# EAGLE design icp_lm2596 (EAGLE 6.3)
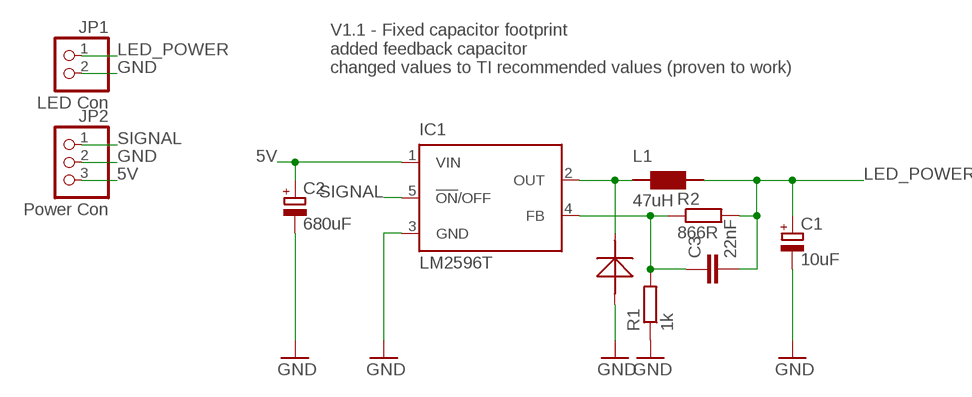
[diagram p0: schematic, sheet 1]

## Parts
C1  10uF  CPOL-EUE2.5-7  [E2,5-7]
C2  680uF  CPOL-EUE3.5-8  [E3,5-8]
C3  22nF  C-EUC0805  [C0805]
D1  SB 550  DIODERM15.24  [DO-201-6X]
IC1  LM2596T  [T05D]
JP1  LED Con  PINHD-1X2  [1X02]
JP2  Power Con  PINHD-1X3  [1X03]
L1  47uH  POWER_INDUCTOR  [PISM]
R1  1k  R-EU_0207/2V  [0207/2V]
R2  866R  R-EU_0207/2V  [0207/2V]

## Nets
5V: C2.+ IC1.1(VIN) JP2.3
GND: C1.- C2.- D1.P$1(A) IC1.3(GND) JP1.2 JP2.2 R1.1
HOT: D1.P$2(C) IC1.2(OUT) L1.P$1
LED_POWER: C1.+ C3.2 JP1.1 L1.P$2 R2.2
N$1: C3.1 IC1.4(FB) R1.2 R2.1
SIGNAL: IC1.5(!ON!/OFF) JP2.1

## Notes on the sheet
- V1.1 - Fixed capacitor footprint
  added feedback capacitor
  changed values to TI recommended values (proven to work)

## Library data of the parts
C1 C2 = rcl:CPOL-EU: POLARIZED CAPACITOR, European symbol
C3 = rcl:C-EU: CAPACITOR, European symbol
D1 = resistor:DIODE: Diode DO-201
IC1 = national-semiconductor:LM2596: SIMPLE SWITCHER® Power Converter 150 kHz 3A Step-Down Voltage Regulator Source: http://www.national.com/ds/LM/LM2596.pdf; MPN: LM2596T-ADJ/LF02; OC_FARNELL: 9494162; OC_NEWARK: 65K5910
JP1 = pinhead:PINHD-1X2: PIN HEADER
JP2 = pinhead:PINHD-1X3: PIN HEADER
L1 = smd:POWER_INDUCTOR: Fastron SMD Power Inductors; REICHELT: L-PISM 15u
R1 R2 = rcl:R-EU_: RESISTOR, European symbol

## Board
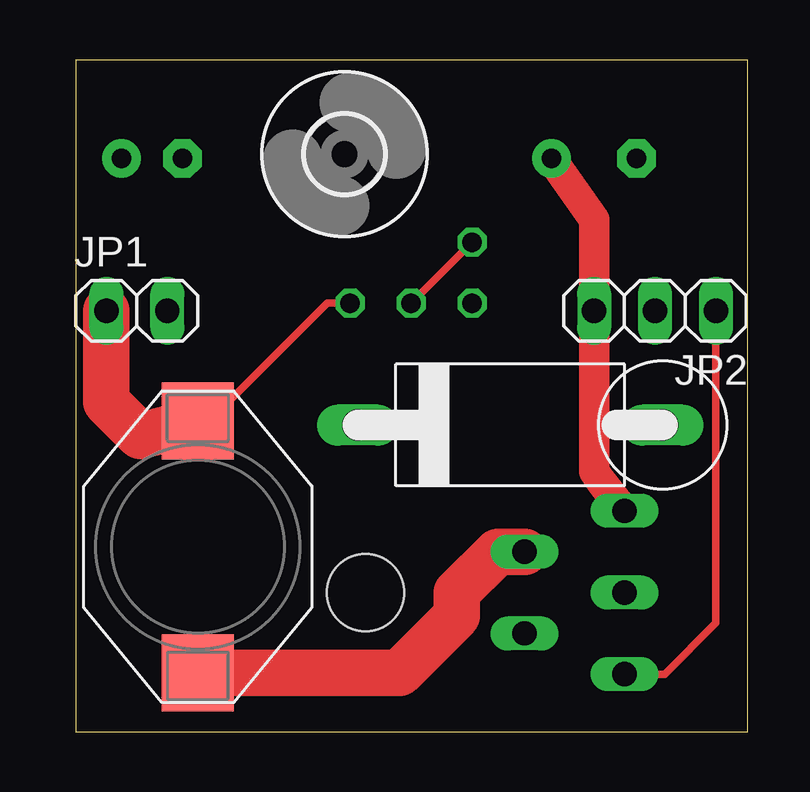
[diagram p1: board, top side]
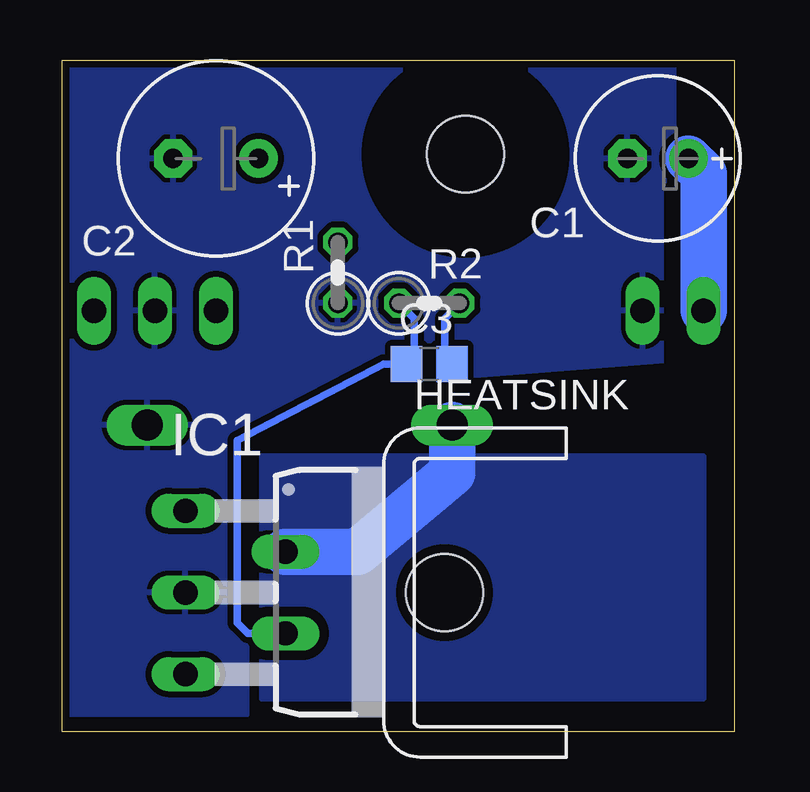
[diagram p2: board, bottom side, seen from below]

Size 28 x 28 mm. Coordinates in mm from the lower left corner, seen from the top.
Outline: 0,0 28,0 28,28 0,28 0,0
Copper layers (1*16): Top 0.035mm / dielectric 1.5mm / Bottom 0.035mm
Design rules "PCB-POOL Standard": minimum track width 0.15mm, minimum drill 0.3mm, track to track 0.15mm, track to pad 0.15mm, pad to pad 0.15mm, via to via 0.15mm, smd to smd 0.15mm, copper to edge 0.3mm, drill to drill 0.2mm, minimum pad ring 0.2mm, minimum via ring 0.15mm, stop-mask expansion 0.075mm, vias tented up to drill 0mil, thermal gap 0.2mm
Holes 3.2 mm at 12.07,5.79
bRestrict: 2 lines

### Footprints (pad centres in the part's own frame; a part is rotated, then mirrored left to right if it is on the bottom)
E2,5-7 = drill 0.813 pad 1.6: + -1.27,0 | drill 0.813 pad 1.6 octagon: - 1.27,0
E3,5-8 = drill 0.813 pad 1.6: + -1.778,0 | drill 0.813 pad 1.6 octagon: - 1.778,0
C0805 = smd 1.3 x 1.5: 1 -0.95,0; 2 0.95,0
DO-201-6X = drill 1.3 long: P$1 -6.35,0; P$2 6.35,0
T05D = drill 1.016 long: 1 -3.404,-5.08; 2 -1.702,-0.914; 3 0,-5.08; 4 1.702,-0.914; 5 3.404,-5.08
1X02 = drill 1.016 long: 1 -1.27,0; 2 1.27,0
1X03 = drill 1.016 long: 1 -2.54,0; 2 0,0; 3 2.54,0
PISM = smd 3 x 3.2: P$1 0,-5.25; P$2 0,5.25
0207/2V = drill 0.813 octagon: 1 -1.27,0; 2 1.27,0
3,2 = hole 3.2: 0,0

### Placement (x,y rotation side)
C1  3.18,23.89 180 bottom
C2  21.59,23.89 180 bottom
C3  12.7,15.32 0 bottom
D1  18.1,12.78 180 top
HEATSINK  [D03S]  13.34,5.79 270 bottom
IC1  17.78,5.79 270 bottom
JP1  2.54,17.54 0 top
JP2  24.13,17.54 180 top
L1  5.08,7.7 0 top
R1  16.51,19.13 90 bottom
R2  12.7,17.86 0 bottom
U$1  [3,2]  11.19,24.07 0 top

### Tracks (layer width: path | path; a pad name or v marks a point on that pad's centre or on a via)
5V
  Top 1.27: C2.+ 21.59,21.35 JP2.3 21.59,10.84 21.85,10.47 IC1.1
GND
  pour Bottom (isolate 0.254): 2.54,27.7 2.54,15 20.32,12.78 20.32,0.71 28.57,0.71 28.57,27.7
HOT
  Top 1.93: L1.P$1 13.51,2.45 15.88,4.82 15.88,5.79 17.58,7.5 IC1.2
  Bottom 1.93: IC1.2 15.68,7.5 11.75,10.79 D1.P$2
  pour Bottom (isolate 0.406): 19.68,11.51 1.27,11.51 1.27,1.35 19.68,1.35
LED_POWER
  Top 0.305: R2.2 10.48,17.86 5.08,12.46 L1.P$2
  Top 1.93: JP1.1 1.27,13.73 2.69,12.32 L1.P$2
  Bottom 0.305: R2.2 12.07,17.23 12.07,15.64 C3.2
  Bottom 1.93: JP1.1 1.27,23.26 C1.+
N$1
  Top 0.305: R1.2 R2.1
  Bottom 0.305: R2.1 13.34,17.23 13.34,15.95 13.65,15.64 C3.1 14.61,15.32 20.7,12.14 20.7,4.53 20.27,4.09 IC1.4
SIGNAL
  Top 0.305: JP2.1 26.67,4.53 24.54,2.39 IC1.5